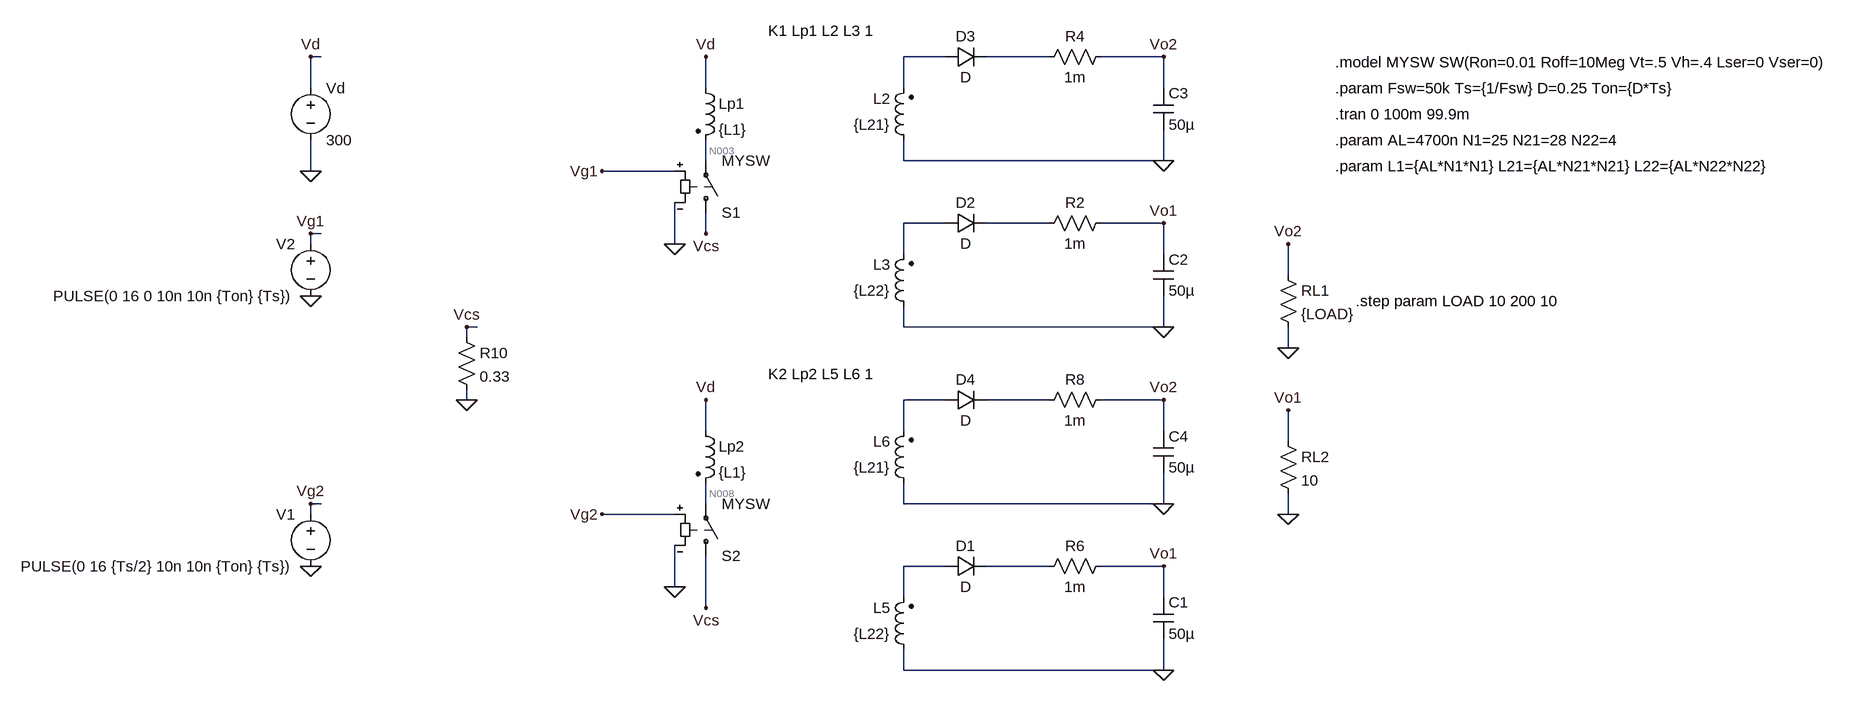
[diagram p0: schematic sch.asc]
sch.asc, the LTspice schematic file:
Version 4
SHEET 1 1500 856
WIRE -832 -336 -848 -336
WIRE 128 -336 64 -336
WIRE 288 -336 192 -336
WIRE 464 -336 368 -336
WIRE -848 -288 -848 -336
WIRE -240 -288 -240 -336
WIRE 64 -288 64 -336
WIRE 464 -288 464 -336
WIRE -240 -176 -240 -208
WIRE 64 -176 64 -208
WIRE 464 -176 464 -224
WIRE 464 -176 64 -176
WIRE -848 -160 -848 -208
WIRE -288 -160 -400 -160
WIRE 128 -80 64 -80
WIRE 288 -80 192 -80
WIRE 464 -80 368 -80
WIRE -832 -64 -848 -64
WIRE -240 -64 -240 -96
WIRE -848 -48 -848 -64
WIRE -288 -48 -288 -112
WIRE 64 -32 64 -80
WIRE 464 -32 464 -80
WIRE 656 0 656 -48
WIRE -592 80 -608 80
WIRE 64 80 64 48
WIRE 464 80 464 32
WIRE 464 80 64 80
WIRE -608 96 -608 80
WIRE 656 112 656 80
WIRE -608 192 -608 176
WIRE 128 192 64 192
WIRE 288 192 192 192
WIRE 464 192 368 192
WIRE -240 240 -240 192
WIRE 64 240 64 192
WIRE 464 240 464 192
WIRE 656 256 656 208
WIRE -832 352 -848 352
WIRE -240 352 -240 320
WIRE 64 352 64 320
WIRE 464 352 464 304
WIRE 464 352 64 352
WIRE -848 368 -848 352
WIRE -288 368 -400 368
WIRE 656 368 656 336
WIRE 128 448 64 448
WIRE 288 448 192 448
WIRE 464 448 368 448
WIRE -288 480 -288 416
WIRE 64 496 64 448
WIRE 464 496 464 448
WIRE -240 512 -240 432
WIRE 64 608 64 576
WIRE 464 608 464 560
WIRE 464 608 64 608
FLAG -848 -160 0
FLAG 464 -80 Vo1
FLAG -288 -48 0
FLAG 464 -336 Vo2
FLAG 464 -176 0
FLAG 464 80 0
FLAG -240 -336 Vd
FLAG -848 -336 Vd
FLAG -848 32 0
FLAG -848 -64 Vg1
FLAG -240 -64 Vcs
FLAG -400 -160 Vg1
FLAG -608 192 0
FLAG 464 448 Vo1
FLAG -288 480 0
FLAG 464 192 Vo2
FLAG 464 352 0
FLAG 464 608 0
FLAG -240 192 Vd
FLAG -240 512 Vcs
FLAG -400 368 Vg2
FLAG -848 448 0
FLAG -848 352 Vg2
FLAG -608 80 Vcs
FLAG 656 112 0
FLAG 656 368 0
FLAG 656 -48 Vo2
FLAG 656 208 Vo1
SYMBOL voltage -848 -304 R0
WINDOW 123 0 0 Left 0
WINDOW 39 0 0 Left 0
SYMATTR InstName Vd
SYMATTR Value 300
SYMBOL voltage -848 -64 M0
WINDOW 123 0 0 Left 0
WINDOW 39 0 0 Left 0
SYMATTR InstName V2
SYMATTR Value PULSE(0 16 0 10n 10n {Ton} {Ts})
SYMBOL ind2 -256 -304 R0
SYMATTR InstName Lp1
SYMATTR Value {L1}
SYMATTR Type ind
SYMBOL ind2 80 64 R180
WINDOW 0 36 80 Left 2
WINDOW 3 36 40 Left 2
SYMATTR InstName L3
SYMATTR Value {L22}
SYMATTR Type ind
SYMBOL sw -240 -80 M180
SYMATTR InstName S1
SYMATTR Value MYSW
SYMBOL diode 128 -64 R270
WINDOW 0 32 32 VTop 2
WINDOW 3 0 32 VBottom 2
SYMATTR InstName D2
SYMBOL res 384 -96 R90
WINDOW 0 0 56 VBottom 2
WINDOW 3 32 56 VTop 2
SYMATTR InstName R2
SYMATTR Value 1m
SYMBOL cap 448 -32 R0
SYMATTR InstName C2
SYMATTR Value 50µ
SYMBOL res 640 240 R0
SYMATTR InstName RL2
SYMATTR Value 10
SYMBOL ind2 80 -192 R180
WINDOW 0 36 80 Left 2
WINDOW 3 36 40 Left 2
SYMATTR InstName L2
SYMATTR Value {L21}
SYMATTR Type ind
SYMBOL diode 128 -320 R270
WINDOW 0 32 32 VTop 2
WINDOW 3 0 32 VBottom 2
SYMATTR InstName D3
SYMBOL res 384 -352 R90
WINDOW 0 0 56 VBottom 2
WINDOW 3 32 56 VTop 2
SYMATTR InstName R4
SYMATTR Value 1m
SYMBOL cap 448 -288 R0
SYMATTR InstName C3
SYMATTR Value 50µ
SYMBOL res 640 -16 R0
SYMATTR InstName RL1
SYMATTR Value {LOAD}
SYMBOL ind2 -256 224 R0
SYMATTR InstName Lp2
SYMATTR Value {L1}
SYMATTR Type ind
SYMBOL ind2 80 592 R180
WINDOW 0 36 80 Left 2
WINDOW 3 36 40 Left 2
SYMATTR InstName L5
SYMATTR Value {L22}
SYMATTR Type ind
SYMBOL sw -240 448 M180
SYMATTR InstName S2
SYMATTR Value MYSW
SYMBOL diode 128 464 R270
WINDOW 0 32 32 VTop 2
WINDOW 3 0 32 VBottom 2
SYMATTR InstName D1
SYMBOL res 384 432 R90
WINDOW 0 0 56 VBottom 2
WINDOW 3 32 56 VTop 2
SYMATTR InstName R6
SYMATTR Value 1m
SYMBOL cap 448 496 R0
SYMATTR InstName C1
SYMATTR Value 50µ
SYMBOL ind2 80 336 R180
WINDOW 0 36 80 Left 2
WINDOW 3 36 40 Left 2
SYMATTR InstName L6
SYMATTR Value {L21}
SYMATTR Type ind
SYMBOL diode 128 208 R270
WINDOW 0 32 32 VTop 2
WINDOW 3 0 32 VBottom 2
SYMATTR InstName D4
SYMBOL res 384 176 R90
WINDOW 0 0 56 VBottom 2
WINDOW 3 32 56 VTop 2
SYMATTR InstName R8
SYMATTR Value 1m
SYMBOL cap 448 240 R0
SYMATTR InstName C4
SYMATTR Value 50µ
SYMBOL res -624 80 R0
SYMATTR InstName R10
SYMATTR Value 0.33
SYMBOL voltage -848 352 M0
WINDOW 123 0 0 Left 0
WINDOW 39 0 0 Left 0
SYMATTR InstName V1
SYMATTR Value PULSE(0 16 {Ts/2} 10n 10n {Ton} {Ts})
TEXT -144 -376 Left 2 !K1 Lp1 L2 L3 1
TEXT 728 -328 Left 2 !.model MYSW SW(Ron=0.01 Roff=10Meg Vt=.5 Vh=.4 Lser=0 Vser=0)
TEXT 728 -248 Left 2 !.tran 0 100m 99.9m
TEXT 728 -288 Left 2 !.param Fsw=50k Ts={1/Fsw} D=0.25 Ton={D*Ts}
TEXT 728 -208 Left 2 !.param AL=4700n N1=25 N21=28 N22=4
TEXT 728 -168 Left 2 !.param L1={AL*N1*N1} L21={AL*N21*N21} L22={AL*N22*N22}
TEXT -144 152 Left 2 !K2 Lp2 L5 L6 1
TEXT 760 40 Left 2 !.step param LOAD 10 200 10

The netlist it stands for:
* sch.asc
Vd Vd 0 300
V2 Vg1 0 PULSE(0 16 0 10n 10n {Ton} {Ts})
Lp1 Vd N003 {L1}
L3 0 N004 {L22}
S1 Vcs N003 Vg1 0 MYSW
D2 N004 N005 D
R2 Vo1 N005 1m
C2 Vo1 0 50µ
RL2 Vo1 0 10
L2 0 N001 {L21}
D3 N001 N002 D
R4 Vo2 N002 1m
C3 Vo2 0 50µ
RL1 Vo2 0 {LOAD}
Lp2 Vd N008 {L1}
L5 0 N009 {L22}
S2 Vcs N008 Vg2 0 MYSW
D1 N009 N010 D
R6 Vo1 N010 1m
C1 Vo1 0 50µ
L6 0 N006 {L21}
D4 N006 N007 D
R8 Vo2 N007 1m
C4 Vo2 0 50µ
R10 Vcs 0 0.33
V1 Vg2 0 PULSE(0 16 {Ts/2} 10n 10n {Ton} {Ts})
.model D D
.lib standard.dio
K1 Lp1 L2 L3 1
.model MYSW SW(Ron=0.01 Roff=10Meg Vt=.5 Vh=.4 Lser=0 Vser=0)
.tran 0 100m 99.9m
.param Fsw=50k Ts={1/Fsw} D=0.25 Ton={D*Ts}
.param AL=4700n N1=25 N21=28 N22=4
.param L1={AL*N1*N1} L21={AL*N21*N21} L22={AL*N22*N22}
K2 Lp2 L5 L6 1
.step param LOAD 10 200 10
.backanno
.end

* Results of the author's LTspice run, read from the files saved beside the schematic
* Operating Point (first step), zero values left out:
*   load = 10 
*   V(vd) = 300 V
*   V(n003) = 300 V
*   V(vcs) = 19.8 µV
*   V(n008) = 300 V
*   I(Lp1) = 30 µA
*   I(Lp2) = 30 µA
*   I(R10) = 60 µA
*   I(S1) = 30 µA
*   I(S2) = 30 µA
*   I(Vd) = -60 µA
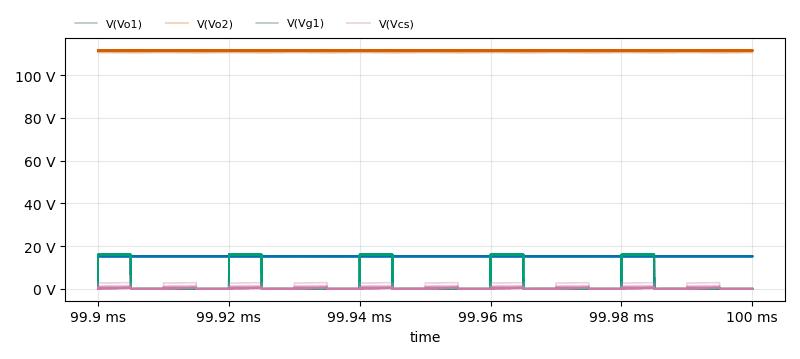
[diagram p1: Transient Analysis of sch.asc, plotted from the saved traces]
* Transient Analysis, 20 runs:
*   V(Vo1) [run 1]: min 15.06 V, max 15.09 V, average 15.08 V, rms 15.08 V, last 15.09 V
*   V(Vo1) [run 2]: min 15.14 V, max 15.16 V, average 15.15 V, rms 15.15 V, last 15.16 V
*   V(Vo1) [run 3]: min 15.16 V, max 15.18 V, average 15.17 V, rms 15.17 V, last 15.18 V
*   V(Vo1) [run 4]: min 15.18 V, max 15.2 V, average 15.19 V, rms 15.19 V, last 15.2 V
*   V(Vo1) [run 5]: min 15.19 V, max 15.21 V, average 15.2 V, rms 15.2 V, last 15.21 V
*   V(Vo1) [run 6]: min 15.19 V, max 15.21 V, average 15.2 V, rms 15.2 V, last 15.21 V
*   V(Vo1) [run 7]: min 15.2 V, max 15.21 V, average 15.21 V, rms 15.21 V, last 15.21 V
*   V(Vo1) [run 8]: min 15.2 V, max 15.22 V, average 15.21 V, rms 15.21 V, last 15.22 V
*   V(Vo2) [run 1]: min 110.4 V, max 110.6 V, average 110.5 V, rms 110.5 V, last 110.6 V
*   V(Vo2) [run 2]: min 111 V, max 111.1 V, average 111 V, rms 111 V, last 111.1 V
*   V(Vo2) [run 3]: min 111.2 V, max 111.2 V, average 111.2 V, rms 111.2 V, last 111.2 V
*   V(Vo2) [run 4]: min 111.3 V, max 111.3 V, average 111.3 V, rms 111.3 V, last 111.3 V
*   V(Vo2) [run 5]: min 111.4 V, max 111.4 V, average 111.4 V, rms 111.4 V, last 111.4 V
*   V(Vo2) [run 6]: min 111.4 V, max 111.5 V, average 111.4 V, rms 111.4 V, last 111.5 V
*   V(Vo2) [run 7]: min 111.4 V, max 111.5 V, average 111.5 V, rms 111.5 V, last 111.5 V
*   V(Vo2) [run 8]: min 111.5 V, max 111.5 V, average 111.5 V, rms 111.5 V, last 111.5 V
*   V(Vg1) [run 1]: min 0 V, max 16 V, average 4.008 V, rms 8.007 V, last 0 V
*   V(Vg1) [run 2]: min 0 V, max 16 V, average 4.008 V, rms 8.007 V, last 0 V
*   V(Vg1) [run 3]: min 0 V, max 16 V, average 4.008 V, rms 8.007 V, last 0 V
*   V(Vg1) [run 4]: min 0 V, max 16 V, average 4.008 V, rms 8.007 V, last 0 V
*   V(Vg1) [run 5]: min 0 V, max 16 V, average 4.008 V, rms 8.007 V, last 0 V
*   V(Vg1) [run 6]: min 0 V, max 16 V, average 4.008 V, rms 8.007 V, last 0 V
*   V(Vg1) [run 7]: min 0 V, max 16 V, average 4.008 V, rms 8.008 V, last 0 V
*   V(Vg1) [run 8]: min 0 V, max 16 V, average 4.008 V, rms 8.007 V, last 0 V
*   V(Vcs) [run 1]: min 26.36 µV, max 2.894 V, average 1.393 V, rms 1.968 V, last 26.37 µV
*   V(Vcs) [run 2]: min 26.26 µV, max 1.525 V, average 713.6 mV, rms 1.008 V, last 26.4 µV
*   V(Vcs) [run 3]: min 26.4 µV, max 1.068 V, average 485.6 mV, rms 686.4 mV, last 26.41 µV
*   V(Vcs) [run 4]: min 26.28 µV, max 832.4 mV, average 371.3 mV, rms 525.3 mV, last 26.41 µV
*   V(Vcs) [run 5]: min 26.29 µV, max 607.9 mV, average 256.7 mV, rms 364.1 mV, last 26.42 µV
*   V(Vcs) [run 6]: min 26.29 µV, max 536.5 mV, average 224 mV, rms 318.1 mV, last 26.42 µV
*   V(Vcs) [run 7]: min 26.29 µV, max 489.1 mV, average 199.4 mV, rms 283.6 mV, last 26.42 µV
*   V(Vcs) [run 8]: min 26.29 µV, max 451.2 mV, average 180.3 mV, rms 257 mV, last 26.42 µV